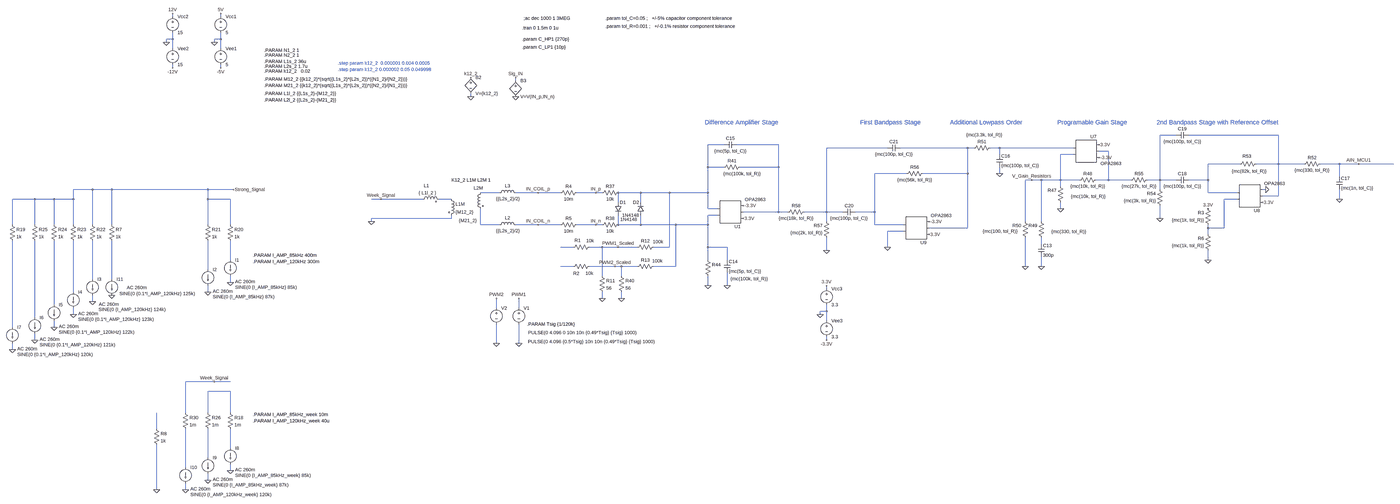
[diagram p0: schematic AFE_Simulation_of_Calib_Circuit_GAIN3.asc, whole sheet]
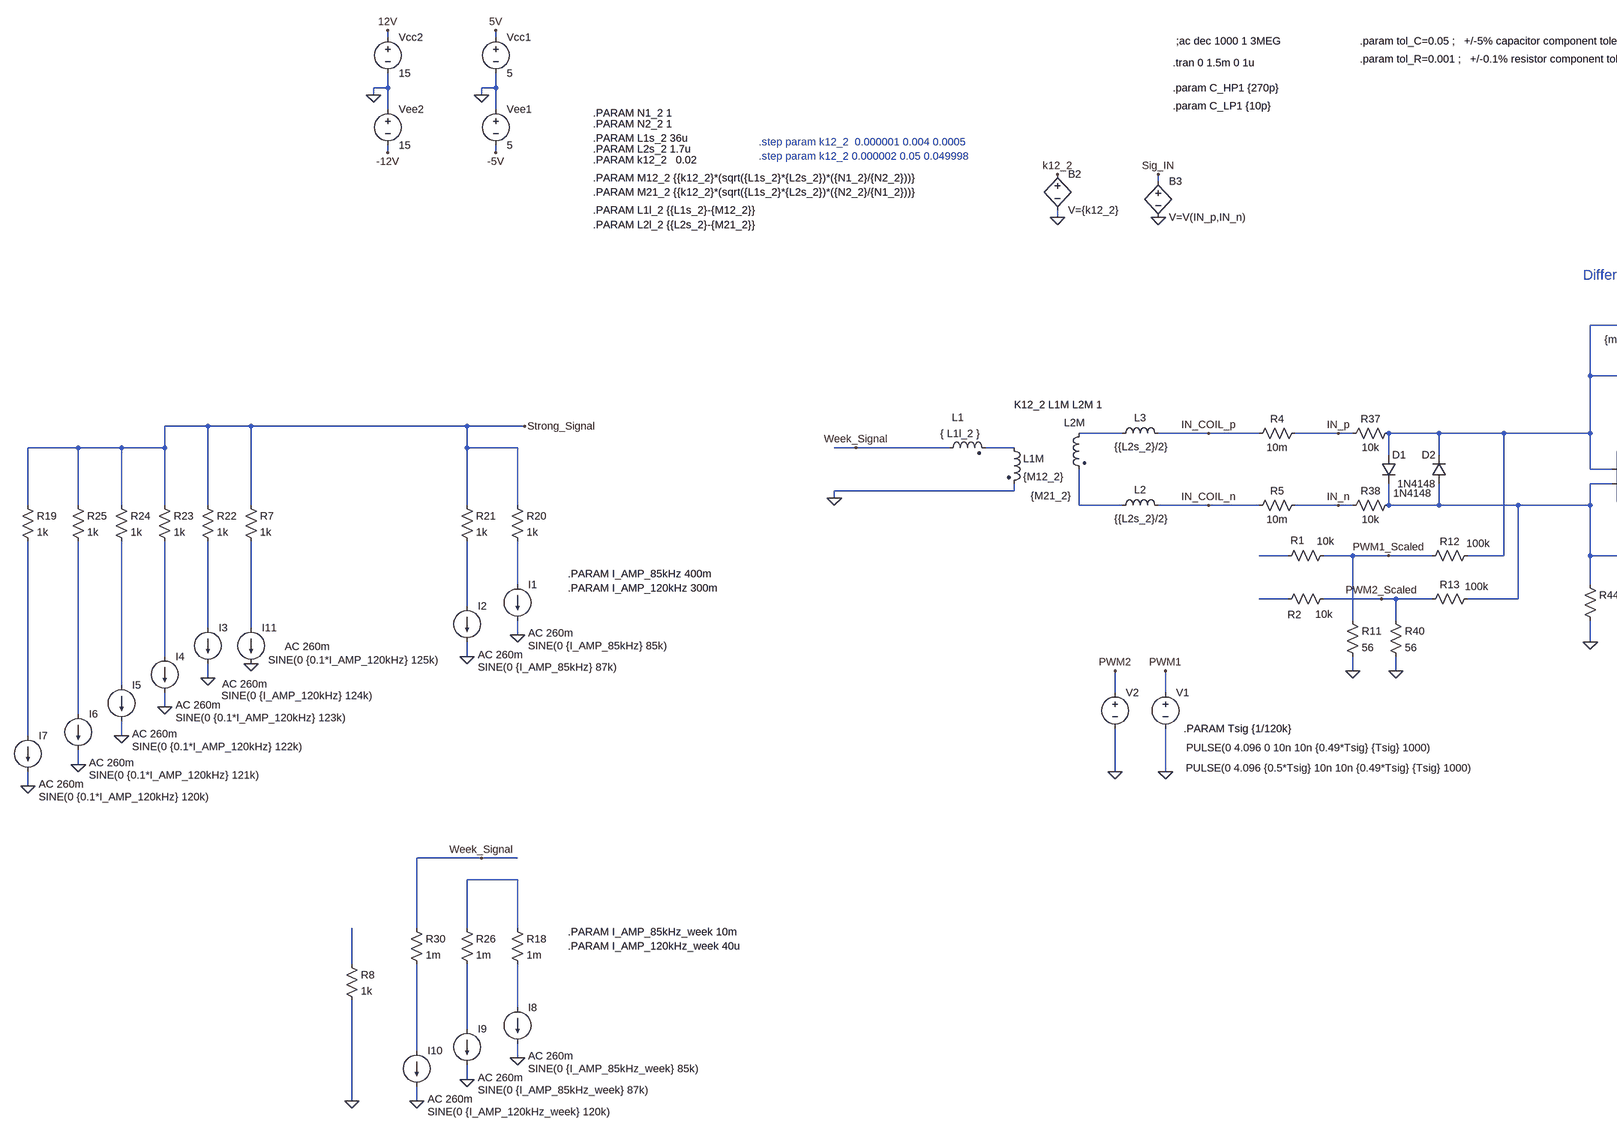
[diagram p1: schematic AFE_Simulation_of_Calib_Circuit_GAIN3.asc, part, row 1 of 1, column 1 of 2]
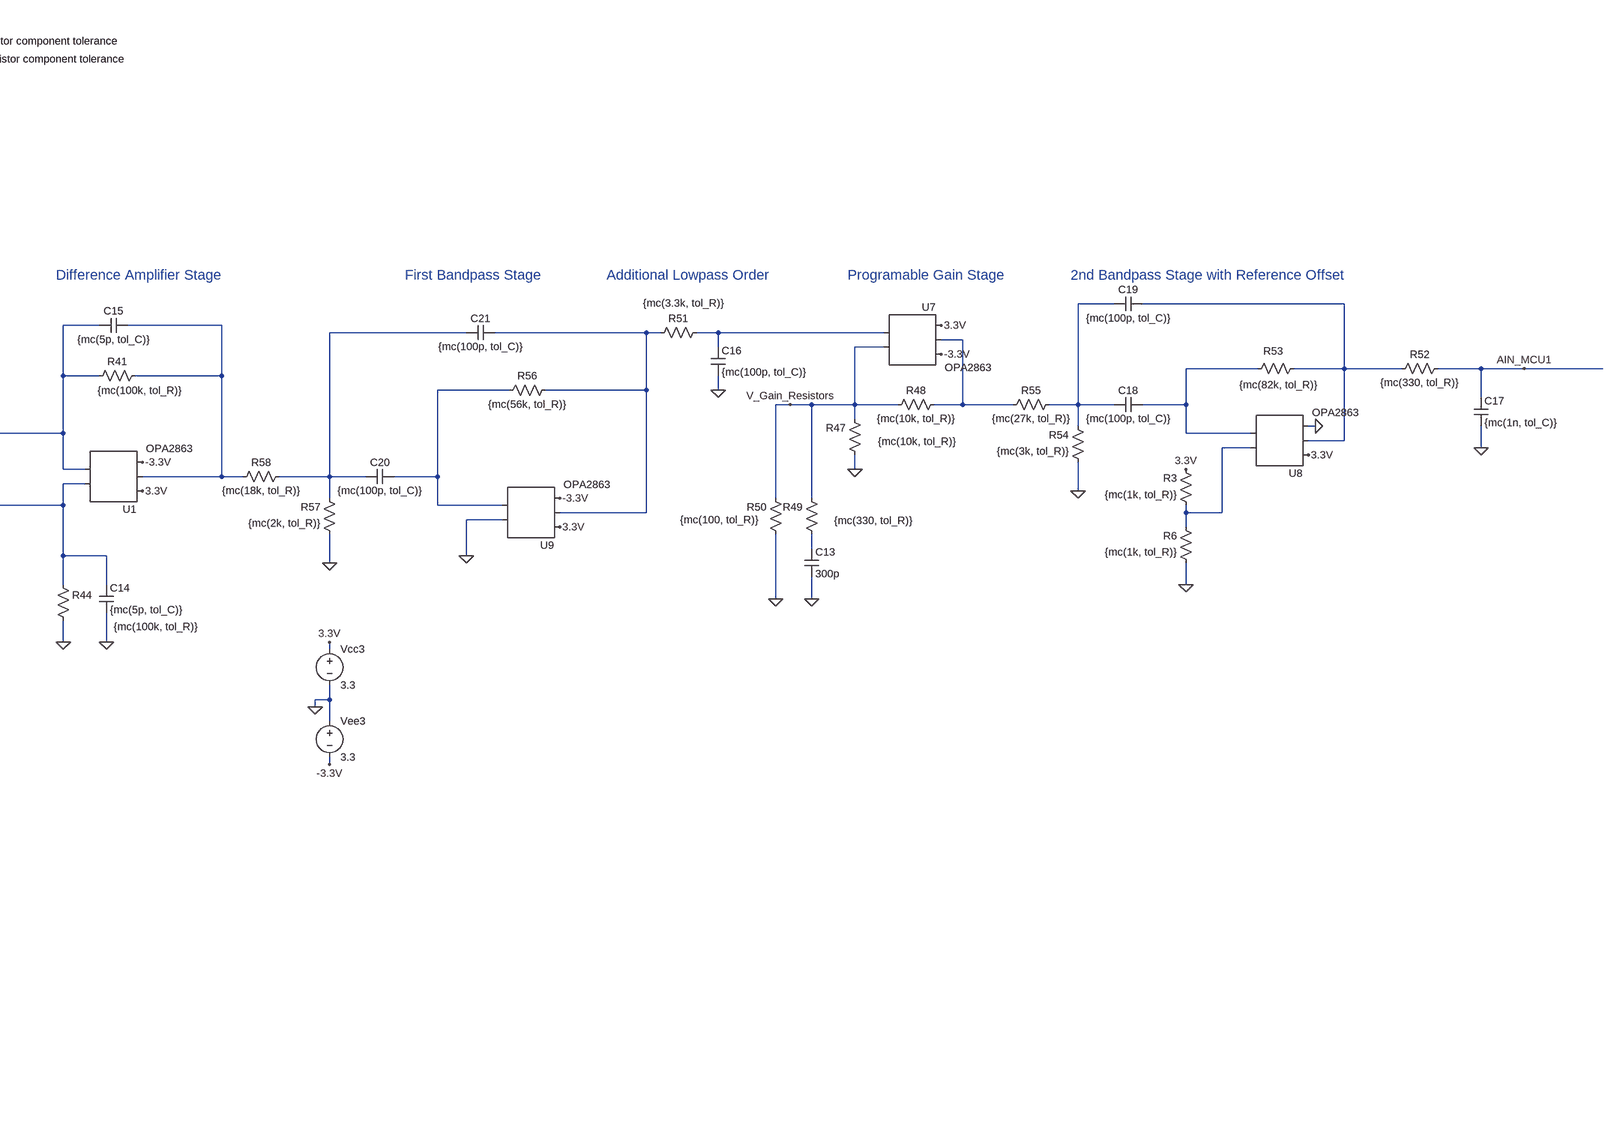
[diagram p2: schematic AFE_Simulation_of_Calib_Circuit_GAIN3.asc, part, row 1 of 1, column 2 of 2]
AFE_Simulation_of_Calib_Circuit_GAIN3.asc, the LTspice schematic file:
Version 4
SHEET 1 5200 8804
WIRE -2928 4752 -2928 4736
WIRE -2688 4752 -2688 4736
WIRE -2928 4864 -2928 4832
WIRE -2928 4864 -2960 4864
WIRE -2688 4864 -2688 4832
WIRE -2688 4864 -2720 4864
WIRE -2960 4880 -2960 4864
WIRE -2720 4880 -2720 4864
WIRE -2928 4912 -2928 4864
WIRE -2688 4912 -2688 4864
WIRE -2928 5008 -2928 4992
WIRE -2688 5008 -2688 4992
WIRE -1216 5072 -1216 5056
WIRE -1440 5152 -1440 5136
WIRE 2080 5344 2000 5344
WIRE 2592 5344 2144 5344
WIRE -176 5392 -256 5392
WIRE 96 5392 -112 5392
WIRE 640 5408 336 5408
WIRE 1040 5408 704 5408
WIRE 1072 5408 1040 5408
WIRE 1200 5408 1152 5408
WIRE 1568 5408 1200 5408
WIRE 1744 5424 1696 5424
WIRE 1200 5440 1200 5408
WIRE 1568 5440 1504 5440
WIRE 2400 5488 2240 5488
WIRE 2592 5488 2592 5344
WIRE 2592 5488 2480 5488
WIRE 2720 5488 2592 5488
WIRE 2896 5488 2800 5488
WIRE 2992 5488 2896 5488
WIRE 3200 5488 2992 5488
WIRE -256 5504 -256 5392
WIRE -176 5504 -256 5504
WIRE 96 5504 96 5392
WIRE 96 5504 -96 5504
WIRE 736 5536 576 5536
WIRE 1040 5536 1040 5408
WIRE 1040 5536 816 5536
WIRE 1200 5536 1200 5504
WIRE 2896 5552 2896 5488
WIRE 1360 5568 1328 5568
WIRE 1408 5568 1360 5568
WIRE 1504 5568 1504 5440
WIRE 1504 5568 1408 5568
WIRE 1600 5568 1504 5568
WIRE 1744 5568 1744 5424
WIRE 1744 5568 1680 5568
WIRE 1856 5568 1744 5568
WIRE 2000 5568 2000 5344
WIRE 2000 5568 1936 5568
WIRE 2080 5568 2000 5568
WIRE 2240 5568 2240 5488
WIRE 2240 5568 2144 5568
WIRE 1504 5600 1504 5568
WIRE -3328 5616 -3424 5616
WIRE -3232 5616 -3328 5616
WIRE -2752 5616 -3232 5616
WIRE -2624 5616 -2752 5616
WIRE 2000 5616 2000 5568
WIRE 2528 5616 2512 5616
WIRE -1296 5632 -1392 5632
WIRE -1104 5632 -1216 5632
WIRE -992 5632 -1104 5632
WIRE -816 5632 -912 5632
WIRE -784 5632 -816 5632
WIRE -592 5632 -704 5632
WIRE -448 5632 -592 5632
WIRE -256 5632 -256 5504
WIRE -256 5632 -448 5632
WIRE 2240 5632 2240 5568
WIRE 2384 5632 2240 5632
WIRE 2592 5648 2592 5488
WIRE 2592 5648 2512 5648
WIRE -3616 5664 -3728 5664
WIRE -3520 5664 -3616 5664
WIRE -3424 5664 -3424 5616
WIRE -3424 5664 -3520 5664
WIRE -2752 5664 -2752 5616
WIRE -2640 5664 -2752 5664
WIRE -1888 5664 -1936 5664
WIRE -1680 5664 -1888 5664
WIRE -1536 5664 -1600 5664
WIRE 2384 5664 2320 5664
WIRE 2896 5664 2896 5616
WIRE -704 5680 -704 5632
WIRE -592 5680 -592 5632
WIRE -256 5712 -256 5632
WIRE -208 5712 -256 5712
WIRE 1504 5712 1504 5680
WIRE 96 5728 96 5504
WIRE 96 5728 -80 5728
WIRE 144 5728 96 5728
WIRE 336 5728 336 5408
WIRE 336 5728 224 5728
WIRE 416 5728 336 5728
WIRE 576 5728 576 5536
WIRE 576 5728 480 5728
WIRE -208 5744 -256 5744
WIRE -1536 5760 -1536 5744
WIRE -1536 5760 -1936 5760
WIRE 2000 5760 2000 5696
WIRE -1936 5776 -1936 5760
WIRE 336 5776 336 5728
WIRE 1328 5776 1328 5568
WIRE 1408 5776 1408 5568
WIRE -3728 5792 -3728 5664
WIRE -3616 5792 -3616 5664
WIRE -3520 5792 -3520 5664
WIRE -3424 5792 -3424 5664
WIRE -3328 5792 -3328 5616
WIRE -3232 5792 -3232 5616
WIRE -2752 5792 -2752 5664
WIRE -2640 5792 -2640 5664
WIRE -1392 5792 -1392 5712
WIRE -1296 5792 -1392 5792
WIRE -1104 5792 -1216 5792
WIRE -992 5792 -1104 5792
WIRE -816 5792 -912 5792
WIRE -784 5792 -816 5792
WIRE -704 5792 -704 5744
WIRE -592 5792 -592 5744
WIRE -592 5792 -704 5792
WIRE -416 5792 -592 5792
WIRE -256 5792 -256 5744
WIRE -256 5792 -416 5792
WIRE 576 5792 576 5728
WIRE 720 5792 576 5792
WIRE 1040 5808 1040 5536
WIRE 1040 5808 848 5808
WIRE 2240 5808 2240 5792
WIRE 2320 5808 2320 5664
WIRE 2320 5808 2240 5808
WIRE 720 5824 640 5824
WIRE 2240 5840 2240 5808
WIRE 1408 5888 1408 5856
WIRE -928 5904 -992 5904
WIRE -784 5904 -848 5904
WIRE -704 5904 -784 5904
WIRE -608 5904 -704 5904
WIRE -448 5904 -448 5632
WIRE -448 5904 -528 5904
WIRE -256 5904 -256 5792
WIRE -160 5904 -256 5904
WIRE 640 5904 640 5824
WIRE 336 5920 336 5856
WIRE -2640 5968 -2640 5872
WIRE -256 5968 -256 5904
WIRE -160 5968 -160 5904
WIRE 2240 5968 2240 5920
WIRE -928 6000 -992 6000
WIRE -720 6000 -848 6000
WIRE -688 6000 -720 6000
WIRE -608 6000 -688 6000
WIRE -416 6000 -416 5792
WIRE -416 6000 -528 6000
WIRE 1328 6000 1328 5856
WIRE 1408 6000 1408 5952
WIRE -2752 6016 -2752 5872
WIRE -784 6048 -784 5904
WIRE -688 6048 -688 6000
WIRE -3328 6064 -3328 5872
WIRE -3232 6064 -3232 5872
WIRE -2640 6080 -2640 6048
WIRE -256 6096 -256 6048
WIRE -160 6096 -160 6032
WIRE 336 6112 336 6096
WIRE -3424 6128 -3424 5872
WIRE -2752 6128 -2752 6096
WIRE -784 6160 -784 6128
WIRE -688 6160 -688 6128
WIRE -3328 6176 -3328 6144
WIRE -3520 6192 -3520 5872
WIRE -1312 6208 -1312 6160
WIRE -1200 6208 -1200 6160
WIRE 336 6224 336 6192
WIRE 336 6224 304 6224
WIRE -3424 6240 -3424 6208
WIRE 304 6240 304 6224
WIRE -3616 6256 -3616 5872
WIRE 336 6272 336 6224
WIRE -3728 6304 -3728 5872
WIRE -3520 6304 -3520 6272
WIRE -3616 6368 -3616 6336
WIRE 336 6368 336 6352
WIRE -1312 6384 -1312 6288
WIRE -1200 6384 -1200 6288
WIRE -3728 6416 -3728 6384
WIRE -2720 6576 -2864 6576
WIRE -2640 6576 -2720 6576
WIRE -2640 6624 -2752 6624
WIRE -2864 6752 -2864 6576
WIRE -2752 6752 -2752 6624
WIRE -2640 6752 -2640 6624
WIRE -3008 6832 -3008 6752
WIRE -2640 6928 -2640 6832
WIRE -2752 6976 -2752 6832
WIRE -2864 7024 -2864 6832
WIRE -2640 7040 -2640 7008
WIRE -2752 7088 -2752 7056
WIRE -3008 7136 -3008 6912
WIRE -2864 7136 -2864 7104
FLAG -1936 5776 0
FLAG -2928 4736 12V
FLAG -2928 5008 -12V
FLAG -2960 4880 0
FLAG -2640 6080 0
FLAG -2752 6128 0
FLAG -3328 6176 0
FLAG -3424 6240 0
FLAG -3520 6304 0
FLAG -3616 6368 0
FLAG -3728 6416 0
FLAG -2688 4736 5V
FLAG -2688 5008 -5V
FLAG -2720 4880 0
FLAG -1200 6160 PWM1
FLAG -1200 6384 0
FLAG -1312 6160 PWM2
FLAG -1312 6384 0
FLAG -1440 5056 k12_2
FLAG -1440 5152 0
FLAG -1216 5152 0
FLAG -1216 5056 Sig_IN
FLAG -816 5632 IN_p
FLAG -816 5792 IN_n
FLAG -2640 7040 0
FLAG -2752 7088 0
FLAG -2864 7136 0
FLAG -2624 5616 Strong_Signal
FLAG -2720 6576 Week_Signal
FLAG -784 6160 0
FLAG -688 6160 0
FLAG -80 5696 -3.3V
FLAG -256 6096 0
FLAG 1504 5712 0
FLAG 1696 5456 -3.3V
FLAG 1408 6000 0
FLAG -160 6096 0
FLAG 1200 5536 0
FLAG 2896 5664 0
FLAG 2992 5488 AIN_MCU1
FLAG 2000 5760 0
FLAG 336 5920 0
FLAG 848 5776 -3.3V
FLAG 640 5904 0
FLAG -704 5904 PWM1_Scaled
FLAG -720 6000 PWM2_Scaled
FLAG 336 6096 3.3V
FLAG 336 6368 -3.3V
FLAG 304 6240 0
FLAG -80 5760 3.3V
FLAG 848 5840 3.3V
FLAG 1696 5392 3.3V
FLAG 2512 5680 3.3V
FLAG 2528 5616 0
FLAG 2240 5968 0
FLAG 2240 5712 3.3V
FLAG -1104 5632 IN_COIL_p
FLAG -1104 5792 IN_COIL_n
FLAG 1360 5568 V_Gain_Resistors
FLAG -3232 6144 0
FLAG 1328 6000 0
FLAG -1888 5664 Week_Signal
FLAG -3008 7136 0
SYMBOL ind2 -1696 5680 R270
WINDOW 0 68 35 VTop 2
WINDOW 3 63 40 VBottom 2
SYMATTR InstName L1
SYMATTR Value { L1l_2 }
SYMATTR Type ind
SYMATTR SpiceLine Rpar=1MEG
SYMBOL ind2 -1376 5616 M0
WINDOW 3 33 155 Left 2
WINDOW 0 2 -8 Left 2
SYMATTR Value {M21_2}
SYMATTR InstName L2M
SYMATTR Type ind
SYMATTR SpiceLine Rser=5 Rpar=1MEG
SYMBOL ind -1312 5648 R270
WINDOW 0 35 56 VTop 2
WINDOW 3 2 58 VBottom 2
SYMATTR InstName L3
SYMATTR Value {{L2s_2}/2}
SYMATTR SpiceLine Rpar=1MegR
SYMBOL ind2 -1552 5648 R0
SYMATTR InstName L1M
SYMATTR Value {M12_2}
SYMATTR Type ind
SYMATTR SpiceLine Rser=100m Rpar=1MEG
SYMBOL voltage -2928 4896 R0
WINDOW 123 0 0 Left 2
SYMATTR InstName Vee2
SYMATTR Value 15
SYMBOL voltage -2928 4736 R0
WINDOW 123 0 0 Left 2
SYMATTR InstName Vcc2
SYMATTR Value 15
SYMBOL ind -1312 5808 R270
WINDOW 0 35 56 VTop 2
WINDOW 3 2 58 VBottom 2
SYMATTR InstName L2
SYMATTR Value {{L2s_2}/2}
SYMATTR SpiceLine Rpar=1MegR
SYMBOL current -2640 5968 R0
WINDOW 3 24 136 Left 2
WINDOW 123 24 108 Left 2
WINDOW 39 0 0 Left 0
SYMATTR Value SINE(0 {I_AMP_85kHz} 85k)
SYMATTR Value2 AC 260m
SYMATTR InstName I1
SYMBOL res -688 5616 R90
WINDOW 0 0 56 VBottom 2
WINDOW 3 32 56 VTop 2
SYMATTR InstName R37
SYMATTR Value 10k
SYMBOL res -688 5776 R90
WINDOW 0 0 56 VBottom 2
WINDOW 3 32 56 VTop 2
SYMATTR InstName R38
SYMATTR Value 10k
SYMBOL current -2752 6016 R0
WINDOW 3 24 136 Left 2
WINDOW 123 24 108 Left 2
WINDOW 39 0 0 Left 0
SYMATTR Value SINE(0 {I_AMP_85kHz} 87k)
SYMATTR Value2 AC 260m
SYMATTR InstName I2
SYMBOL current -3328 6064 R0
WINDOW 3 30 151 Left 2
WINDOW 123 32 125 Left 2
WINDOW 39 0 0 Left 0
SYMATTR Value SINE(0 {I_AMP_120kHz} 124k)
SYMATTR Value2 AC 260m
SYMATTR InstName I3
SYMBOL current -3424 6128 R0
WINDOW 3 24 136 Left 2
WINDOW 123 24 108 Left 2
WINDOW 39 0 0 Left 0
SYMATTR Value SINE(0 {0.1*I_AMP_120kHz} 123k)
SYMATTR Value2 AC 260m
SYMATTR InstName I4
SYMBOL current -3520 6192 R0
WINDOW 3 24 136 Left 2
WINDOW 123 24 108 Left 2
WINDOW 39 0 0 Left 0
SYMATTR Value SINE(0 {0.1*I_AMP_120kHz} 122k)
SYMATTR Value2 AC 260m
SYMATTR InstName I5
SYMBOL current -3616 6256 R0
WINDOW 3 24 136 Left 2
WINDOW 123 24 108 Left 2
WINDOW 39 0 0 Left 0
SYMATTR Value SINE(0 {0.1*I_AMP_120kHz} 121k)
SYMATTR Value2 AC 260m
SYMATTR InstName I6
SYMBOL current -3728 6304 R0
WINDOW 3 24 136 Left 2
WINDOW 123 24 108 Left 2
WINDOW 39 0 0 Left 0
SYMATTR Value SINE(0 {0.1*I_AMP_120kHz} 120k)
SYMATTR Value2 AC 260m
SYMATTR InstName I7
SYMBOL voltage -2688 4896 R0
WINDOW 123 0 0 Left 2
SYMATTR InstName Vee1
SYMATTR Value 5
SYMBOL voltage -2688 4736 R0
WINDOW 123 0 0 Left 2
SYMATTR InstName Vcc1
SYMATTR Value 5
SYMBOL res -3744 5776 R0
SYMATTR InstName R19
SYMATTR Value 1k
SYMBOL res -2656 5776 R0
SYMATTR InstName R20
SYMATTR Value 1k
SYMBOL res -2768 5776 R0
SYMATTR InstName R21
SYMATTR Value 1k
SYMBOL res -3344 5776 R0
SYMATTR InstName R22
SYMATTR Value 1k
SYMBOL res -3440 5776 R0
SYMATTR InstName R23
SYMATTR Value 1k
SYMBOL res -3536 5776 R0
SYMATTR InstName R24
SYMATTR Value 1k
SYMBOL res -3632 5776 R0
SYMATTR InstName R25
SYMATTR Value 1k
SYMBOL diode -720 5680 R0
WINDOW 3 26 85 Left 2
SYMATTR Value 1N4148
SYMATTR InstName D1
SYMBOL diode -576 5744 R180
WINDOW 0 24 64 Left 2
WINDOW 3 24 0 Left 2
SYMATTR InstName D2
SYMATTR Value 1N4148
SYMBOL voltage -1200 6192 R0
WINDOW 123 0 0 Left 0
WINDOW 39 0 0 Left 0
WINDOW 3 46 139 Left 2
SYMATTR Value PULSE(0 4.096 0 10n 10n {0.49*Tsig} {Tsig} 1000)
SYMATTR InstName V1
SYMBOL voltage -1312 6192 R0
WINDOW 123 0 0 Left 0
WINDOW 39 0 0 Left 0
WINDOW 3 157 184 Left 2
SYMATTR Value PULSE(0 4.096 {0.5*Tsig} 10n 10n {0.49*Tsig} {Tsig} 1000)
SYMATTR InstName V2
SYMBOL res -832 5888 R90
WINDOW 0 -2 75 VBottom 2
WINDOW 3 -32 12 VTop 2
SYMATTR InstName R1
SYMATTR Value 10k
SYMBOL res -832 5984 R90
WINDOW 0 67 81 VBottom 2
WINDOW 3 35 16 VTop 2
SYMATTR InstName R2
SYMATTR Value 10k
SYMBOL res -896 5616 R90
WINDOW 0 0 56 VBottom 2
WINDOW 3 32 56 VTop 2
SYMATTR InstName R4
SYMATTR Value 10m
SYMBOL res -896 5776 R90
WINDOW 0 0 56 VBottom 2
WINDOW 3 32 56 VTop 2
SYMATTR InstName R5
SYMATTR Value 10m
SYMBOL bv -1440 5040 R0
SYMATTR InstName B2
SYMATTR Value V={k12_2}
SYMBOL bv -1216 5056 R0
SYMATTR InstName B3
SYMATTR Value V=V(IN_p,IN_n)
SYMBOL res -512 5888 R90
WINDOW 0 0 56 VBottom 2
WINDOW 3 -27 -7 VTop 2
SYMATTR InstName R12
SYMATTR Value 100k
SYMBOL res -512 5984 R90
WINDOW 0 0 56 VBottom 2
WINDOW 3 -27 -4 VTop 2
SYMATTR InstName R13
SYMATTR Value 100k
SYMBOL current -2640 6928 R0
WINDOW 3 24 136 Left 2
WINDOW 123 24 108 Left 2
WINDOW 39 0 0 Left 0
SYMATTR Value SINE(0 {I_AMP_85kHz_week} 85k)
SYMATTR Value2 AC 260m
SYMATTR InstName I8
SYMBOL current -2864 7024 R0
WINDOW 3 24 136 Left 2
WINDOW 123 24 108 Left 2
WINDOW 39 0 0 Left 0
SYMATTR Value SINE(0 {I_AMP_120kHz_week} 120k)
SYMATTR Value2 AC 260m
SYMATTR InstName I10
SYMBOL res -2656 6736 R0
SYMATTR InstName R18
SYMATTR Value 1m
SYMBOL res -2768 6736 R0
SYMATTR InstName R26
SYMATTR Value 1m
SYMBOL res -2880 6736 R0
SYMATTR InstName R30
SYMATTR Value 1m
SYMBOL current -2752 6976 R0
WINDOW 3 24 136 Left 2
WINDOW 123 24 108 Left 2
WINDOW 39 0 0 Left 0
SYMATTR Value SINE(0 {I_AMP_85kHz_week} 87k)
SYMATTR Value2 AC 260m
SYMATTR InstName I9
SYMBOL res -800 6032 R0
SYMATTR InstName R11
SYMATTR Value 56
SYMBOL res -704 6032 R0
SYMATTR InstName R40
SYMATTR Value 56
SYMBOL res -192 5520 R270
WINDOW 0 32 56 VTop 2
WINDOW 3 -1 106 VBottom 2
SYMATTR InstName R41
SYMATTR Value {mc(100k, tol_R)}
SYMBOL res -272 5952 R0
WINDOW 3 128 110 Left 2
SYMATTR Value {mc(100k, tol_R)}
SYMATTR InstName R44
SYMBOL AutoGenerated\\OPA2863 1632 5424 R0
WINDOW 0 36 -57 Bottom 2
SYMATTR InstName U7
SYMBOL res 1520 5696 R180
WINDOW 0 36 76 Left 2
WINDOW 3 -209 46 Left 2
SYMATTR InstName R47
SYMATTR Value {mc(10k, tol_R)}
SYMBOL res 1584 5584 R270
WINDOW 0 32 56 VTop 2
WINDOW 3 0 56 VBottom 2
SYMATTR InstName R48
SYMATTR Value {mc(10k, tol_R)}
SYMBOL res 1424 5872 R180
WINDOW 0 36 76 Left 2
WINDOW 3 -209 46 Left 2
SYMATTR InstName R49
SYMATTR Value {mc(330, tol_R)}
SYMBOL res 1344 5872 R180
WINDOW 0 36 76 Left 2
WINDOW 3 53 48 Left 2
SYMATTR InstName R50
SYMATTR Value {mc(100, tol_R)}
SYMBOL cap 1392 5888 R0
SYMATTR InstName C13
SYMATTR Value 300p
SYMBOL cap -176 5968 R0
SYMATTR InstName C14
SYMATTR Value {mc(5p, tol_C)}
SYMBOL cap -112 5376 R90
WINDOW 0 0 32 VBottom 2
WINDOW 3 32 32 VTop 2
SYMATTR InstName C15
SYMATTR Value {mc(5p, tol_C)}
SYMBOL res 1168 5392 R90
WINDOW 0 0 56 VBottom 2
WINDOW 3 -65 45 VTop 2
SYMATTR InstName R51
SYMATTR Value {mc(3.3k, tol_R)}
SYMBOL cap 1184 5440 R0
SYMATTR InstName C16
SYMATTR Value {mc(100p, tol_C)}
SYMBOL res 2816 5472 R90
WINDOW 0 0 56 VBottom 2
WINDOW 3 32 56 VTop 2
SYMATTR InstName R52
SYMATTR Value {mc(330, tol_R)}
SYMBOL cap 2880 5552 R0
SYMATTR InstName C17
SYMATTR Value {mc(1n, tol_C)}
SYMBOL AutoGenerated\\OPA2863 2448 5648 M180
WINDOW 0 36 -57 Bottom 2
SYMATTR InstName U8
SYMBOL cap 2080 5584 R270
WINDOW 0 32 32 VTop 2
WINDOW 3 0 32 VBottom 2
SYMATTR InstName C18
SYMATTR Value {mc(100p, tol_C)}
SYMBOL cap 2144 5328 R90
WINDOW 0 0 32 VBottom 2
WINDOW 3 32 32 VTop 2
SYMATTR InstName C19
SYMATTR Value {mc(100p, tol_C)}
SYMBOL res 2496 5472 R90
WINDOW 0 -7 62 VBottom 2
WINDOW 3 37 50 VTop 2
SYMATTR InstName R53
SYMATTR Value {mc(82k, tol_R)}
SYMBOL res 2016 5712 R180
WINDOW 0 36 76 Left 2
WINDOW 3 36 40 Left 2
SYMATTR InstName R54
SYMATTR Value {mc(3k, tol_R)}
SYMBOL res 1952 5552 R90
WINDOW 0 0 56 VBottom 2
WINDOW 3 32 56 VTop 2
SYMATTR InstName R55
SYMATTR Value {mc(27k, tol_R)}
SYMBOL AutoGenerated\\OPA2863 784 5808 M180
WINDOW 0 36 -57 Bottom 2
SYMATTR InstName U9
SYMBOL cap 416 5744 R270
WINDOW 0 32 32 VTop 2
WINDOW 3 0 32 VBottom 2
SYMATTR InstName C20
SYMATTR Value {mc(100p, tol_C)}
SYMBOL cap 704 5392 R90
WINDOW 0 0 32 VBottom 2
WINDOW 3 32 32 VTop 2
SYMATTR InstName C21
SYMATTR Value {mc(100p, tol_C)}
SYMBOL res 832 5520 R90
WINDOW 0 0 56 VBottom 2
WINDOW 3 32 56 VTop 2
SYMATTR InstName R56
SYMATTR Value {mc(56k, tol_R)}
SYMBOL res 352 5872 R180
WINDOW 0 36 76 Left 2
WINDOW 3 36 40 Left 2
SYMATTR InstName R57
SYMATTR Value {mc(2k, tol_R)}
SYMBOL res 240 5712 R90
WINDOW 0 0 56 VBottom 2
WINDOW 3 32 56 VTop 2
SYMATTR InstName R58
SYMATTR Value {mc(18k, tol_R)}
SYMBOL AutoGenerated\\OPA2863 -144 5728 M180
WINDOW 0 36 -57 Bottom 2
SYMATTR InstName U1
SYMBOL voltage 336 6256 R0
WINDOW 123 0 0 Left 2
SYMATTR InstName Vee3
SYMATTR Value 3.3
SYMBOL voltage 336 6096 R0
WINDOW 123 0 0 Left 2
SYMATTR InstName Vcc3
SYMATTR Value 3.3
SYMBOL res 2256 5808 R180
WINDOW 0 36 76 Left 2
WINDOW 3 36 40 Left 2
SYMATTR InstName R3
SYMATTR Value {mc(1k, tol_R)}
SYMBOL res 2256 5936 R180
WINDOW 0 36 76 Left 2
WINDOW 3 36 40 Left 2
SYMATTR InstName R6
SYMATTR Value {mc(1k, tol_R)}
SYMBOL current -3232 6064 R0
WINDOW 3 38 72 Left 2
WINDOW 123 75 42 Left 2
WINDOW 39 0 0 Left 0
SYMATTR Value SINE(0 {0.1*I_AMP_120kHz} 125k)
SYMATTR Value2 AC 260m
SYMATTR InstName I11
SYMBOL res -3248 5776 R0
SYMATTR InstName R7
SYMATTR Value 1k
SYMBOL res -3024 6816 R0
SYMATTR InstName R8
SYMATTR Value 1k
TEXT -1184 4808 Left 2 !.tran 0 1.5m 0 1u
TEXT -1536 5568 Left 2 !K12_2 L1M L2M 1
TEXT -1176 4760 Left 2 !;ac dec 1000 1 3MEG
TEXT -2472 5024 Left 2 !.PARAM k12_2   0.02
TEXT -2472 5064 Left 2 !.PARAM M12_2 {{k12_2}*(sqrt({L1s_2}*{L2s_2})*({N1_2}/{N2_2}))}
TEXT -2472 5096 Left 2 !.PARAM M21_2 {{k12_2}*(sqrt({L1s_2}*{L2s_2})*({N2_2}/{N1_2}))}
TEXT -2472 4976 Left 2 !.PARAM L1s_2 36u
TEXT -2472 5000 Left 2 !.PARAM L2s_2 1.7u
TEXT -2472 4920 Left 2 !.PARAM N1_2 1
TEXT -2472 4944 Left 2 !.PARAM N2_2 1
TEXT -2472 5136 Left 2 !.PARAM L1l_2 {{L1s_2}-{M12_2}}
TEXT -2472 5168 Left 2 !.PARAM L2l_2 {{L2s_2}-{M21_2}}
TEXT -1184 4864 Left 2 !.param C_HP1 {270p}
TEXT -1184 4904 Left 2 !.param C_LP1 {10p}
TEXT -2528 5976 Left 2 !.PARAM I_AMP_120kHz 300m
TEXT -2528 5944 Left 2 !.PARAM I_AMP_85kHz 400m
TEXT -1160 6288 Left 2 !.PARAM Tsig {1/120k}
TEXT -2104 4984 Left 2 ;.step param k12_2  0.000001 0.004 0.0005
TEXT -2104 5016 Left 2 ;.step param k12_2 0.000002 0.05 0.049998
TEXT -768 4760 Left 2 !.param tol_C=0.05 ;   +/-5% capacitor component tolerance
TEXT -768 4800 Left 2 !.param tol_R=0.001 ;   +/-0.1% resistor component tolerance
TEXT -2528 6792 Left 2 !.PARAM I_AMP_120kHz_week 40u
TEXT -2528 6760 Left 2 !.PARAM I_AMP_85kHz_week 10m
TEXT -272 5280 Left 3 ;Difference Amplifier Stage
TEXT 504 5280 Left 3 ;First Bandpass Stage
TEXT 952 5280 Left 3 ;Additional Lowpass Order
TEXT 1488 5280 Left 3 ;Programable Gain Stage
TEXT 1984 5280 Left 3 ;2nd Bandpass Stage with Reference Offset

The netlist it stands for:
* AFE_Simulation_of_Calib_Circuit_GAIN3.asc
L1 Week_Signal N012 { L1l_2 } Rpar=1MEG
L2M N011 N015 {M21_2} Rser=5 Rpar=1MEG
L3 N011 IN_COIL_p {{L2s_2}/2} Rpar=1MegR
L1M N012 0 {M12_2} Rser=100m Rpar=1MEG
Vee2 0 -12V 15
Vcc2 12V 0 15
L2 N015 IN_COIL_n {{L2s_2}/2} Rpar=1MegR
I1 N018 0 SINE(0 {I_AMP_85kHz} 85k) AC 260m
R37 N003 IN_p 10k
R38 N014 IN_n 10k
I2 N020 0 SINE(0 {I_AMP_85kHz} 87k) AC 260m
I3 N021 0 SINE(0 {I_AMP_120kHz} 124k) AC 260m
I4 N023 0 SINE(0 {0.1*I_AMP_120kHz} 123k) AC 260m
I5 N024 0 SINE(0 {0.1*I_AMP_120kHz} 122k) AC 260m
I6 N025 0 SINE(0 {0.1*I_AMP_120kHz} 121k) AC 260m
I7 N026 0 SINE(0 {0.1*I_AMP_120kHz} 120k) AC 260m
Vee1 0 -5V 5
Vcc1 5V 0 5
R19 Strong_Signal N026 1k
R20 Strong_Signal N018 1k
R21 Strong_Signal N020 1k
R22 Strong_Signal N021 1k
R23 Strong_Signal N023 1k
R24 Strong_Signal N024 1k
R25 Strong_Signal N025 1k
D1 N003 N014 1N4148
D2 N014 N003 1N4148
V1 PWM1 0 PULSE(0 4.096 0 10n 10n {0.49*Tsig} {Tsig} 1000)
V2 PWM2 0 PULSE(0 4.096 {0.5*Tsig} 10n 10n {0.49*Tsig} {Tsig} 1000)
R1 PWM1_Scaled N017 10k
R2 PWM2_Scaled N019 10k
R4 IN_p IN_COIL_p 10m
R5 IN_n IN_COIL_n 10m
B2 k12_2 0 V={k12_2}
B3 Sig_IN 0 V=V(IN_p,IN_n)
R12 N003 PWM1_Scaled 100k
R13 N014 PWM2_Scaled 100k
I8 N029 0 SINE(0 {I_AMP_85kHz_week} 85k) AC 260m
I10 N031 0 SINE(0 {I_AMP_120kHz_week} 120k) AC 260m
R18 N027 N029 1m
R26 N027 N030 1m
R30 Week_Signal N031 1m
I9 N030 0 SINE(0 {I_AMP_85kHz_week} 87k) AC 260m
R11 PWM1_Scaled 0 56
R40 PWM2_Scaled 0 56
R41 N003 N004 {mc(100k, tol_R)}
R44 N014 0 {mc(100k, tol_R)}
* U7: OPA2863 (symbol AutoGenerated\OPA2863 not available, pins judged from their places): pin1=N007 pin2=V_Gain_Resistors pin3=3.3V pin4=N008 pin5=-3.3V
R47 0 V_Gain_Resistors {mc(10k, tol_R)}
R48 V_Gain_Resistors N008 {mc(10k, tol_R)}
R49 N016 V_Gain_Resistors {mc(330, tol_R)}
R50 0 V_Gain_Resistors {mc(100, tol_R)}
C13 N016 0 300p
C14 N014 0 {mc(5p, tol_C)}
C15 N004 N003 {mc(5p, tol_C)}
R51 N007 N006 {mc(3.3k, tol_R)}
C16 N007 0 {mc(100p, tol_C)}
R52 AIN_MCU1 N002 {mc(330, tol_R)}
C17 AIN_MCU1 0 {mc(1n, tol_C)}
* U8: OPA2863 (symbol AutoGenerated\OPA2863 not available, pins judged from their places): pin1=N013 pin2=N009 pin3=3.3V pin4=N002 pin5=0
C18 N001 N009 {mc(100p, tol_C)}
C19 N002 N001 {mc(100p, tol_C)}
R53 N002 N009 {mc(82k, tol_R)}
R54 0 N001 {mc(3k, tol_R)}
R55 N001 N008 {mc(27k, tol_R)}
* U9: OPA2863 (symbol AutoGenerated\OPA2863 not available, pins judged from their places): pin1=0 pin2=N010 pin3=3.3V pin4=N006 pin5=-3.3V
C20 N005 N010 {mc(100p, tol_C)}
C21 N006 N005 {mc(100p, tol_C)}
R56 N006 N010 {mc(56k, tol_R)}
R57 0 N005 {mc(2k, tol_R)}
R58 N005 N004 {mc(18k, tol_R)}
* U1: OPA2863 (symbol AutoGenerated\OPA2863 not available, pins judged from their places): pin1=N014 pin2=N003 pin3=3.3V pin4=N004 pin5=-3.3V
Vee3 0 -3.3V 3.3
Vcc3 3.3V 0 3.3
R3 N013 3.3V {mc(1k, tol_R)}
R6 0 N013 {mc(1k, tol_R)}
I11 N022 0 SINE(0 {0.1*I_AMP_120kHz} 125k) AC 260m
R7 Strong_Signal N022 1k
R8 N028 0 1k
.model D D
.lib standard.dio
.tran 0 1.5m 0 1u
K12_2 L1M L2M 1
;ac dec 1000 1 3MEG
.PARAM k12_2   0.02
.PARAM M12_2 {{k12_2}*(sqrt({L1s_2}*{L2s_2})*({N1_2}/{N2_2}))}
.PARAM M21_2 {{k12_2}*(sqrt({L1s_2}*{L2s_2})*({N2_2}/{N1_2}))}
.PARAM L1s_2 36u
.PARAM L2s_2 1.7u
.PARAM N1_2 1
.PARAM N2_2 1
.PARAM L1l_2 {{L1s_2}-{M12_2}}
.PARAM L2l_2 {{L2s_2}-{M21_2}}
.param C_HP1 {270p}
.param C_LP1 {10p}
.PARAM I_AMP_120kHz 300m
.PARAM I_AMP_85kHz 400m
.PARAM Tsig {1/120k}
* .step param k12_2  0.000001 0.004 0.0005
* .step param k12_2 0.000002 0.05 0.049998
.param tol_C=0.05 ;   +/-5% capacitor component tolerance
.param tol_R=0.001 ;   +/-0.1% resistor component tolerance
.PARAM I_AMP_120kHz_week 40u
.PARAM I_AMP_85kHz_week 10m
* Difference Amplifier Stage
* First Bandpass Stage
* Additional Lowpass Order
* Programable Gain Stage
* 2nd Bandpass Stage with Reference Offset
.backanno
.end